# EAGLE schematic TPS62160 (EAGLE 6.5.0)
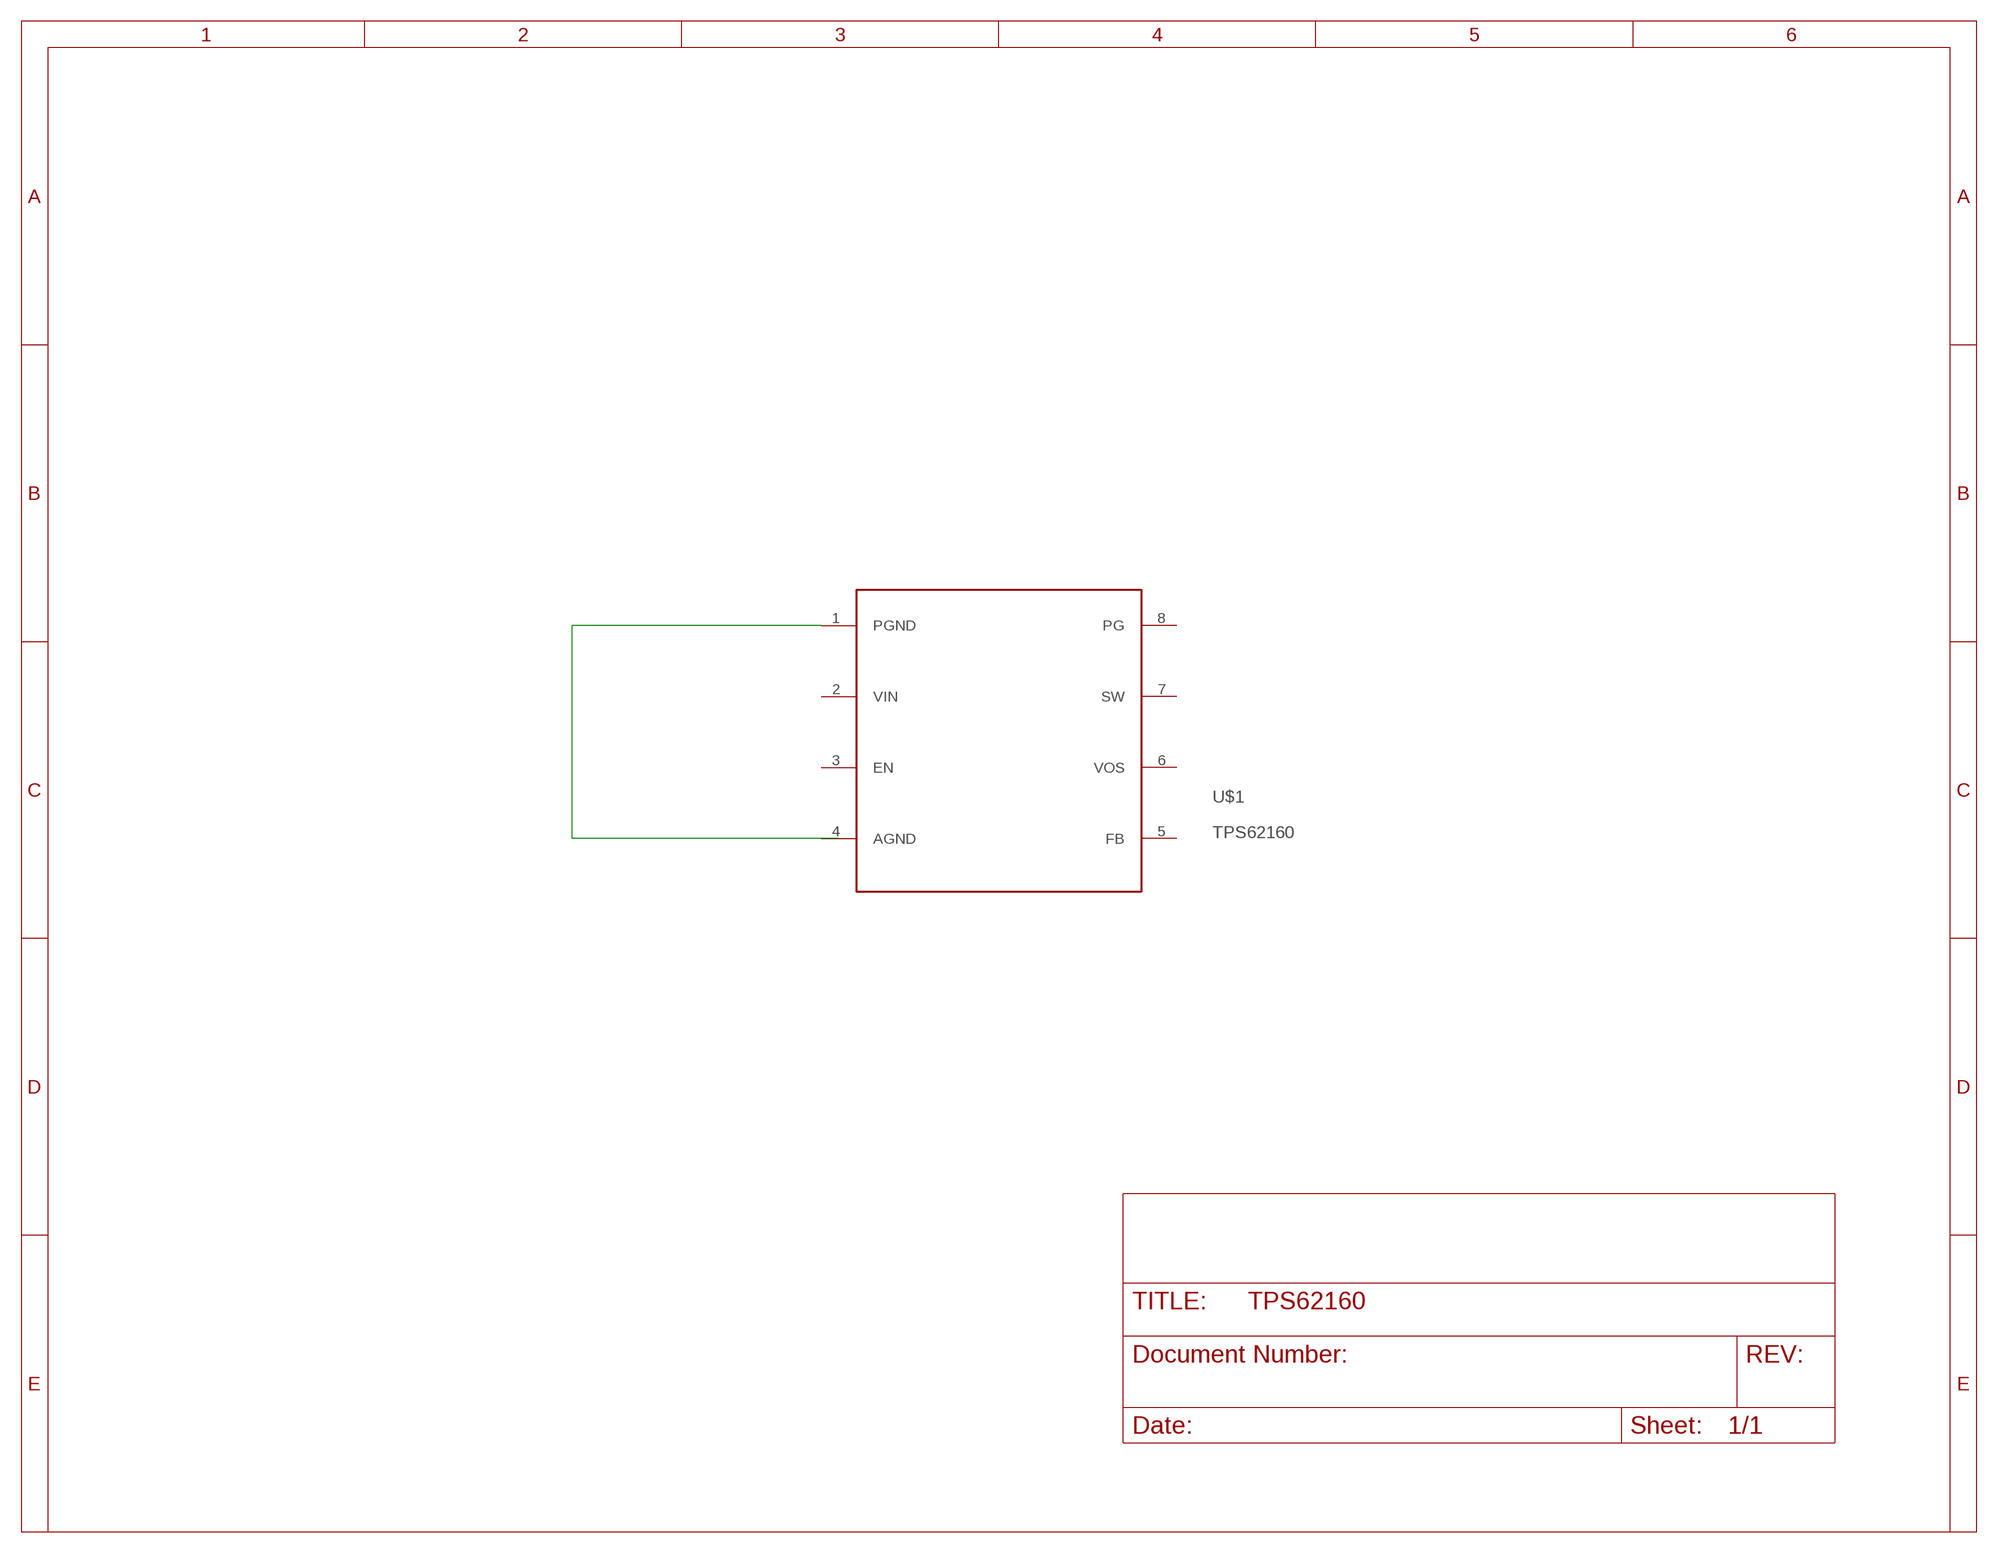
[diagram p0: schematic, sheet 1]

## Parts
U$1  TPS62160  [DGK]

## Nets
N$1: U$1.1(PGND)
Unconnected: U$1.2(VIN) U$1.3(EN) U$1.4(AGND) U$1.5(FB) U$1.6(VOS) U$1.7(SW) U$1.8(PG)

## Library data of the parts
U$1 = TPS62160:TPS62160